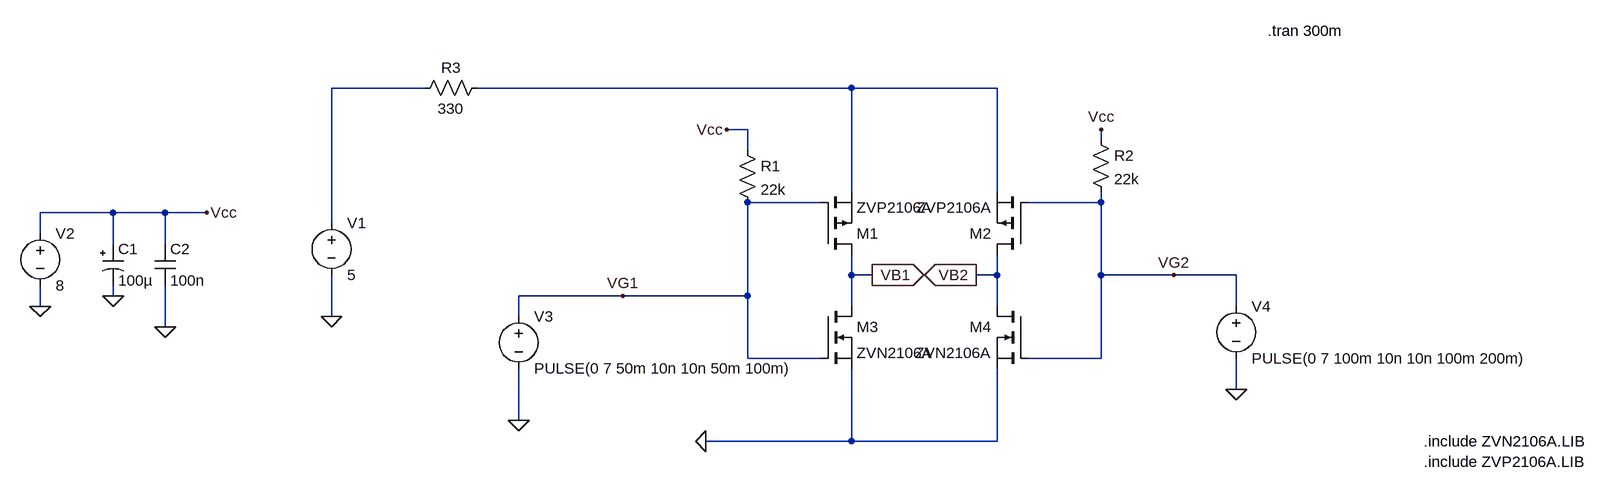
[diagram p0: schematic EXP3.B.7 Direction Control in LTspice.asc]
EXP3.B.7 Direction Control in LTspice.asc, the LTspice schematic file:
Version 4
SHEET 1 1276 680
WIRE -528 0 -672 0
WIRE 128 0 -448 0
WIRE 352 0 128 0
WIRE -32 64 -64 64
WIRE 512 80 512 64
WIRE -32 96 -32 64
WIRE 128 160 128 0
WIRE 352 160 352 0
WIRE 80 176 -32 176
WIRE 512 176 512 160
WIRE 512 176 400 176
WIRE -1008 192 -1120 192
WIRE -928 192 -1008 192
WIRE -864 192 -928 192
WIRE -672 208 -672 0
WIRE -1120 224 -1120 192
WIRE -1008 240 -1008 192
WIRE -928 240 -928 192
WIRE 128 288 128 256
WIRE 160 288 128 288
WIRE 352 288 352 256
WIRE 352 288 320 288
WIRE 512 288 512 176
WIRE 624 288 512 288
WIRE 720 288 624 288
WIRE -1008 320 -1008 304
WIRE -224 320 -384 320
WIRE -32 320 -32 176
WIRE -32 320 -224 320
WIRE -1120 336 -1120 304
WIRE 128 336 128 288
WIRE 352 336 352 288
WIRE 720 336 720 288
WIRE -672 352 -672 288
WIRE -384 352 -384 320
WIRE -928 368 -928 304
WIRE -32 416 -32 320
WIRE 80 416 -32 416
WIRE 512 416 512 288
WIRE 512 416 400 416
WIRE 720 464 720 416
WIRE -384 512 -384 432
WIRE 128 544 128 432
WIRE 128 544 -96 544
WIRE 352 544 352 432
WIRE 352 544 128 544
FLAG 160 288 VB1
IOPIN 160 288 Out
FLAG 320 288 VB2
IOPIN 320 288 Out
FLAG -384 512 0
FLAG -96 544 0
FLAG -1120 336 0
FLAG -1008 320 0
FLAG -928 368 0
FLAG -864 192 Vcc
FLAG -672 352 0
FLAG 720 464 0
FLAG -64 64 Vcc
FLAG 512 64 Vcc
FLAG -224 320 VG1
FLAG 624 288 VG2
SYMBOL pmos 80 256 M180
SYMATTR InstName M1
SYMATTR Value ZVP2106A
SYMBOL pmos 400 256 R180
SYMATTR InstName M2
SYMATTR Value ZVP2106A
SYMBOL nmos 80 336 R0
SYMATTR InstName M3
SYMATTR Value ZVN2106A
SYMBOL nmos 400 336 M0
SYMATTR InstName M4
SYMATTR Value ZVN2106A
SYMBOL res -48 80 R0
SYMATTR InstName R1
SYMATTR Value 22k
SYMBOL res 496 64 R0
SYMATTR InstName R2
SYMATTR Value 22k
SYMBOL voltage -672 192 R0
WINDOW 123 0 0 Left 0
WINDOW 39 0 0 Left 0
SYMATTR InstName V1
SYMATTR Value 5
SYMBOL voltage -1120 208 R0
WINDOW 123 0 0 Left 0
WINDOW 39 0 0 Left 0
SYMATTR InstName V2
SYMATTR Value 8
SYMBOL voltage -384 336 R0
WINDOW 123 0 0 Left 0
WINDOW 39 0 0 Left 0
SYMATTR InstName V3
SYMATTR Value PULSE(0 7 50m 10n 10n 50m 100m)
SYMBOL polcap -1024 240 R0
SYMATTR InstName C1
SYMATTR Value 100µ
SYMBOL cap -944 240 R0
SYMATTR InstName C2
SYMATTR Value 100n
SYMBOL res -544 16 R270
WINDOW 0 32 56 VTop 2
WINDOW 3 0 56 VBottom 2
SYMATTR InstName R3
SYMATTR Value 330
SYMBOL voltage 720 320 R0
WINDOW 123 0 0 Left 0
WINDOW 39 0 0 Left 0
SYMATTR InstName V4
SYMATTR Value PULSE(0 7 100m 10n 10n 100m 200m)
TEXT 1008 544 Left 2 !.include ZVN2106A.LIB\n.include ZVP2106A.LIB
TEXT 768 -88 Left 2 !.tran 300m

The netlist it stands for:
* EXP3.B.7 Direction Control in LTspice.asc
M1 VB1 VG1 N002 N002 ZVP2106A
M2 VB2 VG2 N002 N002 ZVP2106A
M3 VB1 VG1 0 0 ZVN2106A
M4 VB2 VG2 0 0 ZVN2106A
R1 Vcc VG1 22k
R2 Vcc VG2 22k
V1 N001 0 5
V2 Vcc 0 8
V3 VG1 0 PULSE(0 7 50m 10n 10n 50m 100m)
C1 Vcc 0 100µ
C2 Vcc 0 100n
R3 N001 N002 330
V4 VG2 0 PULSE(0 7 100m 10n 10n 100m 200m)
.model NMOS NMOS
.model PMOS PMOS
.lib standard.mos
.include ZVN2106A.LIB
.include ZVP2106A.LIB
.tran 300m
.backanno
.end